# EAGLE design UHF_RFID_Nano_Shield (EAGLE 7.2.0)
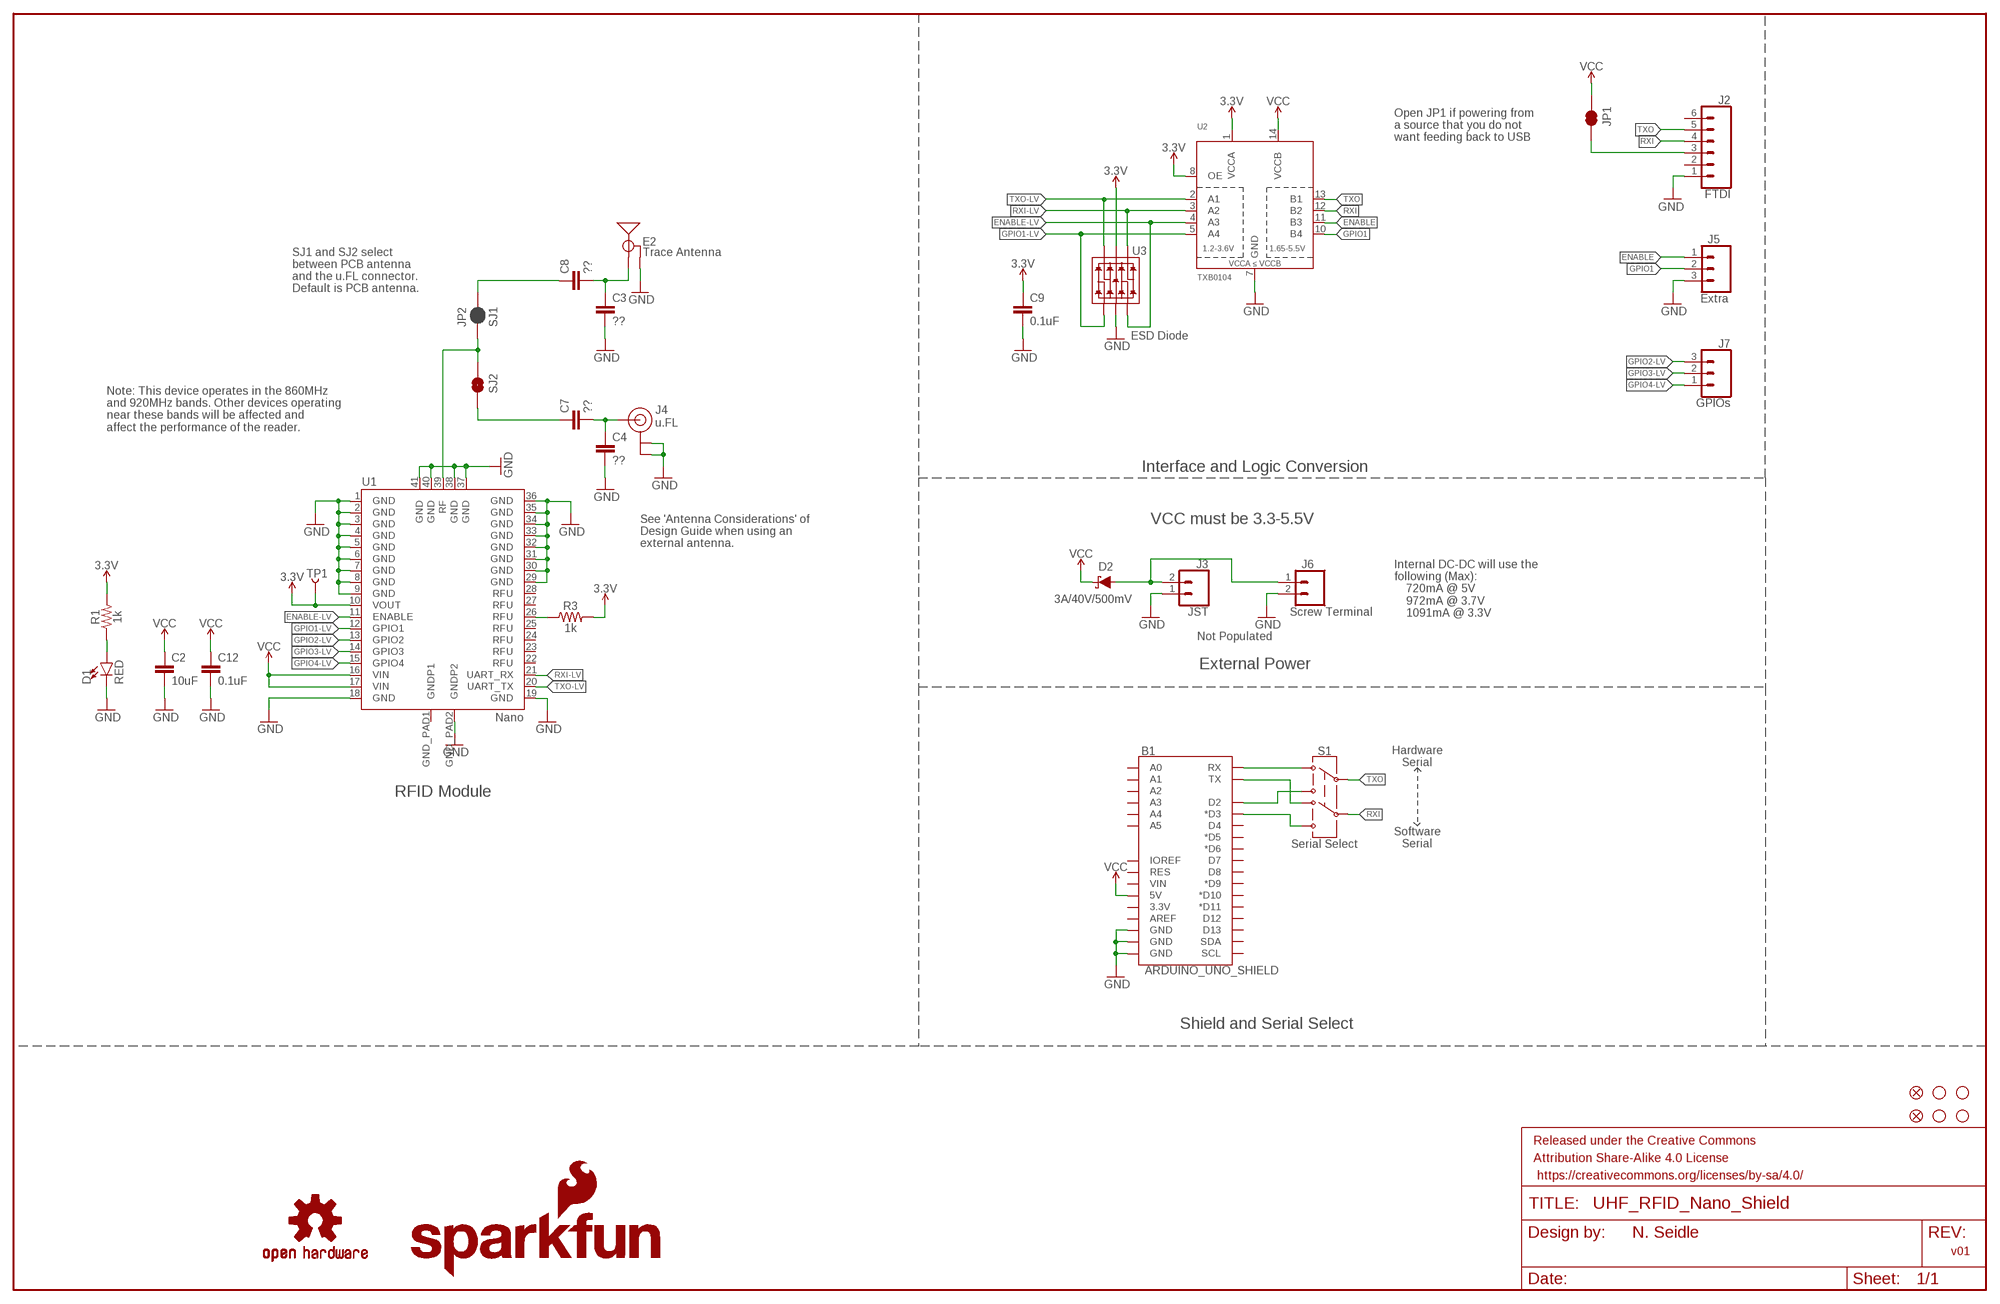
[diagram p0: schematic, sheet 1]

## Parts
B1  ARDUINO_UNO_SHIELD  ARDUINO_UNO_R3_SHIELDBASIC  [UNO_R3_SHIELD]
C2  10uF  10UF-0805-10V-10%  [0805]
C3  ??  1.0PF-0603-50V-25%  [0603]
C4  ??  1.0PF-0603-50V-25%  [0603]
C7  ??  1.0PF-0603-50V-25%  [0603]
C8  ??  1.0PF-0603-50V-25%  [0603]
C9  0.1uF  0.1UF-0603-25V-(+80/-20%)  [0603]
C12  0.1uF  0.1UF-0603-25V-(+80/-20%)  [0603]
D1  RED  LED-RED0603  [LED-0603]
D2  3A/40V/500mV  DIODE-SCHOTTKY-B340A  [SMA-DIODE]
E2  Trace Antenna  ANTENNA_GROUNDED1  [915MHZ_ANTENNA_TRIMBLE]
FID1  FIDUCIAL1X2  [FIDUCIAL-1X2]
FID2  FIDUCIAL1X2  [FIDUCIAL-1X2]
FRAME1  FRAME-LEDGER  [CREATIVE_COMMONS]
J2  FTDI  CONN_06SILK_FEMALE_PTH  [1X06]
J3  JST  CONN_02JST-PTH-2  [JST-2-PTH]
J4  U.FL  [U.FL]
J5  Extra  CONN_03  [1X03]
J6  Screw Terminal  CONN_023.5MM  [SCREWTERMINAL-3.5MM-2]
J7  GPIOs  CONN_03  [1X03]
JP1  JUMPER-SMT_2_NC_TRACE_SILK  [SMT-JUMPER_2_NC_TRACE_SILK]
JP2  SJ1  JUMPER-SMT_2_NO_NO-SILK  [SMT-JUMPER_2_NO_NO-SILK]
LOGO1  SFE_LOGO_NAME_FLAME.1_INCH  [SFE_LOGO_NAME_FLAME_.1]
LOGO2  OSHW-LOGOS  [OSHW-LOGO-S]
LOGO3  SFE_LOGO_NAME_FLAME.1_INCH  [SFE_LOGO_NAME_FLAME_.1]
R1  1k  1KOHM-0603-1/10W-1%  [0603]
R3  1k  1KOHM-0603-1/10W-1%  [0603]
S1  Serial Select  SWITCH-DPDT-SMD-AYZ0202  [SWITCH_DPDT_SMD_AYZ0202]
SJ2  JUMPER-SMT_2_NO_NO-SILK  [SMT-JUMPER_2_NO_NO-SILK]
STANDOFF1  STAND-OFF  [STAND-OFF]
STANDOFF2  STAND-OFF  [STAND-OFF]
STANDOFF3  STAND-OFF  [STAND-OFF]
STANDOFF4  STAND-OFF  [STAND-OFF]
TP1  TEST-POINT3  [PAD.03X.03]
U1  Nano  UHF_RFID_NANO_MODULE  [NANO_MODULE]
U2  TXB0104  TXB0104PWRSOIC14  [SO14]
U3  ESD Diode  TVS_DIODE_ARRAYSMD  [SOT-23-6]

## Nets
3.3V: C9.1 R1.2 R3.2 TP1.P$1 U1.10(VOUT) U2.1(VCCA) U2.8(OE) U3.5(VCC)
ANT3: JP2.1 SJ2.1 U1.39(RF)
ENABLE: J5.1 U2.11(B3)
ENABLE-LV: U1.11(ENABLE) U2.4(A3) U3.3(IO2)
GND [power]: B1.GND@0(GND) B1.GND@1(GND) B1.GND@2(GND) C2.2 C3.2 C4.2 C9.2 C12.2 D1.C E2.GND@1(GND) E2.GND@2(GND) E2.GND@3(GND) J2.1 J3.1 J4.P$1(GND) J4.P$2(GND) J5.3 J6.2 U1.1(GND) U1.2(GND) U1.3(GND) U1.4(GND) U1.5(GND) U1.6(GND) U1.7(GND) U1.8(GND) U1.9(GND) U1.18(GND) U1.19(GND) U1.29(GND) U1.30(GND) U1.31(GND) U1.32(GND) U1.33(GND) U1.34(GND) U1.35(GND) U1.36(GND) U1.37(GND) U1.38(GND) U1.40(GND) U1.41(GND) U1.GND_PAD2(GNDP2) U2.7(GND) U3.2(VSS)
GPIO1: J5.2 U2.10(B4)
GPIO1-LV: U1.12(GPIO1) U2.5(A4) U3.1(IO1)
GPIO2-LV: J7.3 U1.13(GPIO2)
GPIO3-LV: J7.2 U1.14(GPIO3)
GPIO4-LV: J7.1 U1.15(GPIO4)
N$1: C3.1 C8.2 E2.ANT(SIGNAL)
N$2: C8.1 JP2.2
N$3: C7.1 SJ2.2
N$4: R3.1 U1.26(RFU)
N$5: C4.1 C7.2 J4.P$3(SIGNAL)
N$6: D1.A R1.1
N$7: J2.3 JP1.2
N$8: B1.RX S1.1
N$9: B1.TX S1.4
N$12: D2.A J3.2 J6.1
RXI: J2.4 S1.5 U2.12(B2)
RXI-LV: U1.21(UART_RX) U2.3(A2) U3.4(IO3)
SOFT-RX: B1.D2 S1.3
SOFT-TX: B1.D3(*D3) S1.6
TXO: J2.5 S1.2 U2.13(B1)
TXO-LV: U1.20(UART_TX) U2.2(A1) U3.6(IO4)
VCC: B1.5V C2.1 C12.1 D2.C JP1.1 U1.16(VIN) U1.17(VIN) U2.14(VCCB)
Unconnected: B1.3.3V B1.A0 B1.A1 B1.A2 B1.A3 B1.A4 B1.A5 B1.AREF B1.D4 B1.D5(*D5) B1.D6(*D6) B1.D7 B1.D8 B1.D9(*D9) B1.D10(*D10) B1.D11(*D11) B1.D12 B1.D13 B1.IOREF B1.RES B1.SCL B1.SDA B1.VIN J2.2 J2.6 U1.22(RFU) U1.23(RFU) U1.24(RFU) U1.25(RFU) U1.27(RFU) U1.28(RFU) U1.GND_PAD1(GNDP1)

## Notes on the sheet
- Open JP1 if powering from
  a source that you do not
  want feeding back to USB
- SJ1 and SJ2 select
  between PCB antenna
  and the u.FL connector.
- Default is PCB antenna.
- u.FL
- Note: This device operates in the 860MHz
  and 920MHz bands. Other devices operating
  near these bands will be affected and 
  affect the performance of the reader.
- Interface and Logic Conversion
- VCC must be 3.3-5.5V
- See 'Antenna Considerations' of 
  Design Guide when using an 
  external antenna.
- Internal DC-DC will use the 
  following (Max): 
      720mA @ 5V
      972mA @ 3.7V
      1091mA @ 3.3V
- Not Populated
- External Power
- Hardware
  Serial
- RFID Module
- Software
  Serial
- Shield and Serial Select
- N. Seidle
- v01

## Library data of the parts
B1 = SparkFun-Boards:ARDUINO_UNO_R3_SHIELD: Arduino R3 Shield Footprint Shield form compatible with the Arduino Uno R3. SparkFun Products: MG2639 Cellular Shield <https://www.sparkfun.com/products/13120> MIDI Shield <https://www.sparkfun.com/products/12898> R3 Stackable Headers Kit <https://www.sparkfun.com/products/11417>
C2 = SparkFun-Capacitors:10UF: 10.0µF ceramic capacitors A capacitor is a passive two-terminal electrical component used to store electrical energy temporarily in an electric field.; PROD_ID: CAP-11330
C3 C4 C7 C8 = SparkFun-Capacitors:1.0PF: 1pF ceramic capacitors A capacitor is a passive two-terminal electrical component used to store electrical energy temporarily in an electric field.; PROD_ID: CAP-07879; VALUE: 1.0pF
C9 C12 = SparkFun-Capacitors:0.1UF: 0.1µF ceramic capacitors A capacitor is a passive two-terminal electrical component used to store electrical energy temporarily in an electric field.; PROD_ID: CAP-00810
D1 = SparkFun-LED:LED-RED: Red SMD LED Used in manufacturing of most products at SparkFun Packages: 0603 - SMD 0603 package [Product Link] <http://docs.avagotech.com/docs/AV02-0551EN> 0603 SMART - SMD 0603 SMART package ( more efficient and expensive)[Product Link] <http://www.osram-os.com/Graphics/XPic2/00077099_0.pdf> 1206 - SMD1206 package [Product Link] <https://www.sparkfun.com/datasheets/DevTools/LilyPad/Q150OVS4.pdff> SparkFun Products: Pro Mini 328 -5V <https://www.sparkfun.com/products/821> RedBoard <https://www.sparkfun.com/products/12757> IOIO-OTG <https://www.sparkfun.com/products/13613>; PROD_ID: DIO-00819
D2 = SparkFun-DiscreteSemi:DIODE-SCHOTTKY: Schottky diode A Schottky diode is a semiconductor diode which has a low forward voltage drop and a very fast switching action.; PROD_ID: DIO-09886
E2 = UHF_RFID_Nano_Module:ANTENNA_GROUNDED
FID1 FID2 = SparkFun-Aesthetics:FIDUCIAL: Fiducial Alignment Points Point-of-reference for pick-and-place machines and other optical instruments.
FRAME1 = SparkFun-Aesthetics:FRAME-LEDGER: Schematic Frame - Ledger Standard 11x14 US Ledger frame
J2 = SparkFun-Connectors:CONN_06: Multi connection point. Often used as Generic Header-pin footprint for 0.1 inch spaced/style header connections On any of the 0.1 inch spaced packages, you can populate with these: Break Away Headers - Straight <https://www.sparkfun.com/products/116> (PRT-00116) Break Away Male Headers - Right Angle <https://www.sparkfun.com/products/553> (PRT-00553) Female Headers <https://www.sparkfun.com/products/115> (PRT-00115) Break Away Headers - Machine Pin <https://www.sparkfun.com/products/117> (PRT-00117) Break Away Female Headers - Swiss Machine Pin <https://www.sparkfun.com/products/743> (PRT-00743) Arduino Stackable Header - 6 Pin <https://www.sparkfun.com/products/9280> (PRT-09280) For SCREWTERMINALS and SPRING TERMINALS visit here: Screw Terimnals on SparkFun.com <https://www.sparkfun.com/search/results?term=Screw+Terminals> (5mm/3.5mm/2.54mm spacing) This device is also useful as a general connection point to wire up your design to another part of your project. Our various solder wires solder well into these plated through hole pads. Hook-Up Wire - Assortment (Stranded, 22 AWG) <https://www.sparkfun.com/products/11375> (PRT-11375) Hook-Up Wire - Assortment (Solid Core, 22 AWG) <https://www.sparkfun.com/products/11367> (PRT-11367) View the entire wire category on our website here <https://www.sparkfun.com/categories/141> Special notes: Molex polarized connector foot print use with SKU : PRT-08231 with associated crimp pins and housings. 1MM SMD Version SKU: PRT-10208 NOTES ON THE VARIANTS LOCK and LOCK_LONGPADS... This footprint was designed to help hold the alignment of a through-hole component (i.e. 6-pin header) while soldering it into place. You may notice that each hole has been shifted either up or down by 0.005 of an inch from it's more standard position (which is a perfectly straight line). This slight alteration caused the pins (the squares in the middle) to touch the edges of the holes. Because they are alternating, it causes a "brace" to hold the component in place. 0.005 has proven to be the perfect amount of "off-center" position when using our standard breakaway headers. Although looks a little odd when you look at the bare footprint, once you have a header in there, the alteration is very hard to notice. Also,if you push a header all the way into place, it is covered up entirely on the bottom side.; PROD_ID: CONN-08437
J3 = SparkFun-Connectors:CONN_02: Multi connection point. Often used as Generic Header-pin footprint for 0.1 inch spaced/style header connections On any of the 0.1 inch spaced packages, you can populate with these: Break Away Headers - Straight <https://www.sparkfun.com/products/116> (PRT-00116) Break Away Male Headers - Right Angle <https://www.sparkfun.com/products/553> (PRT-00553) Female Headers <https://www.sparkfun.com/products/115> (PRT-00115) Break Away Headers - Machine Pin <https://www.sparkfun.com/products/117> (PRT-00117) Break Away Female Headers - Swiss Machine Pin <https://www.sparkfun.com/products/743> (PRT-00743) For SCREWTERMINALS and SPRING TERMINALS visit here: Screw Terimnals on SparkFun.com <https://www.sparkfun.com/search/results?term=Screw+Terminals> (5mm/3.5mm/2.54mm spacing) This device is also useful as a general connection point to wire up your design to another part of your project. Our various solder wires solder well into these plated through hole pads. Hook-Up Wire - Assortment (Stranded, 22 AWG) <https://www.sparkfun.com/products/11375> (PRT-11375) Hook-Up Wire - Assortment (Solid Core, 22 AWG) <https://www.sparkfun.com/products/11367> (PRT-11367) View the entire wire category on our website here <https://www.sparkfun.com/categories/141> Special notes: Molex polarized connector foot print use with: PRT-08233 with associated crimp pins and housings. 2.54_SCREWTERM for use with PRT-10571. 3.5mm Screw Terminal footprints for PRT-08084 5mm Screw Terminal footprints for use with PRT-08432; PROD_ID: CONN-09863; SKU: PRT-09914
J4 = SparkFun-Connectors:U.FL: SMD antenna connector- WRL-09144; PROD_ID: CONN-09193
J5 J7 = SparkFun-Connectors:CONN_03: Multi connection point. Often used as Generic Header-pin footprint for 0.1 inch spaced/style header connections On any of the 0.1 inch spaced packages, you can populate with these: Break Away Headers - Straight <https://www.sparkfun.com/products/116> (PRT-00116) Break Away Male Headers - Right Angle <https://www.sparkfun.com/products/553> (PRT-00553) Female Headers <https://www.sparkfun.com/products/115> (PRT-00115) Break Away Headers - Machine Pin <https://www.sparkfun.com/products/117> (PRT-00117) Break Away Female Headers - Swiss Machine Pin <https://www.sparkfun.com/products/743> (PRT-00743) Stackable Header - 3 Pin (Female, 0.1") <https://www.sparkfun.com/products/13875> (PRT-13875) For SCREWTERMINALS and SPRING TERMINALS visit here: Screw Terimnals on SparkFun.com <https://www.sparkfun.com/search/results?term=Screw+Terminals> (5mm/3.5mm/2.54mm spacing) This device is also useful as a general connection point to wire up your design to another part of your project. Our various solder wires solder well into these plated through hole pads. Hook-Up Wire - Assortment (Stranded, 22 AWG) <https://www.sparkfun.com/products/11375> (PRT-11375) Hook-Up Wire - Assortment (Solid Core, 22 AWG) <https://www.sparkfun.com/products/11367> (PRT-11367) View the entire wire category on our website here <https://www.sparkfun.com/categories/141> Special notes: Molex polarized connector foot print use with SKU : PRT-08232 with associated crimp pins and housings.
J6 = SparkFun-Connectors:CONN_02: Multi connection point. Often used as Generic Header-pin footprint for 0.1 inch spaced/style header connections On any of the 0.1 inch spaced packages, you can populate with these: Break Away Headers - Straight <https://www.sparkfun.com/products/116> (PRT-00116) Break Away Male Headers - Right Angle <https://www.sparkfun.com/products/553> (PRT-00553) Female Headers <https://www.sparkfun.com/products/115> (PRT-00115) Break Away Headers - Machine Pin <https://www.sparkfun.com/products/117> (PRT-00117) Break Away Female Headers - Swiss Machine Pin <https://www.sparkfun.com/products/743> (PRT-00743) For SCREWTERMINALS and SPRING TERMINALS visit here: Screw Terimnals on SparkFun.com <https://www.sparkfun.com/search/results?term=Screw+Terminals> (5mm/3.5mm/2.54mm spacing) This device is also useful as a general connection point to wire up your design to another part of your project. Our various solder wires solder well into these plated through hole pads. Hook-Up Wire - Assortment (Stranded, 22 AWG) <https://www.sparkfun.com/products/11375> (PRT-11375) Hook-Up Wire - Assortment (Solid Core, 22 AWG) <https://www.sparkfun.com/products/11367> (PRT-11367) View the entire wire category on our website here <https://www.sparkfun.com/categories/141> Special notes: Molex polarized connector foot print use with: PRT-08233 with associated crimp pins and housings. 2.54_SCREWTERM for use with PRT-10571. 3.5mm Screw Terminal footprints for PRT-08084 5mm Screw Terminal footprints for use with PRT-08432; PROD_ID: CONN-08399
JP1 = SparkFun-Jumpers:JUMPER-SMT_2_NC_TRACE: Normally closed trace jumper This jumper has a trace between two pads so it's normally closed (NC). Use a razor knife to open the connection. For best results follow the IPC guidelines for cutting traces: Cutout at least 0.063 mm (0.005 in). Remove all loose material to clean up the cut area. Seal the cut with an approved epoxy. Reapply solder to reclose the connection.
JP2 SJ2 = SparkFun-Jumpers:JUMPER-SMT_2_NO: Normally open jumper This jumper has two pads in close proximity to each other. Apply solder to close the connection. Round pads are easier to solder for beginners, but are a lot larger. SparkFun Product that uses the round pads: SparkFun EL Sequencer <https://www.sparkfun.com/products/12781>
LOGO1 LOGO3 = SparkFun-Aesthetics:SFE_LOGO_NAME_FLAME: SparkFun Font Logo w/ Flame This is the SparkFun full logo. The logo on the schematic will always be the same size; the package variant is the height of the flame part of the logo. Default layer for the logo on the board is tSilk.
LOGO2 = SparkFun-Aesthetics:OSHW-LOGO: Open-Source Hardware (OSHW) Logo This logo indicates the piece of hardware it is found on incorporates a OSHW license and/or adheres to the definition of open source hardware found here: http://freedomdefined.org/OSHW
R1 R3 = SparkFun-Resistors:1KOHM: 1kΩ resistor A resistor is a passive two-terminal electrical component that implements electrical resistance as a circuit element. Resistors act to reduce current flow, and, at the same time, act to lower voltage levels within circuits. - Wikipedia; PROD_ID: RES-07856
S1 = SparkFun-Switches:SWITCH-DPDT: Double-Pole, Double-Throw (DPDT) Switch Double-pole, double-throw switches. Variant Overview PTH-GPI-152-3013 Used on SparkFun Geiger Counter <https://www.sparkfun.com/products/11345> SMD-AY0202 Surface Mount DPDT Switch <https://www.sparkfun.com/products/597> (COM-00597) Used on e.g. LilyPad Arduino USB - ATmega32U4 Board <https://www.sparkfun.com/products/12049>; PROD_ID: SWCH-08179; SF_SKU: COM-00597
STANDOFF1-STANDOFF4 = SparkFun-Electromechanical:STAND-OFF: #4 Stand Off This is the mechanical footprint for a #4 phillips button head screw. Use the keepout ring to avoid running the screw head into surrounding components. SKU : PRT-00447
TP1 = SparkFun-Connectors:TEST-POINT: Bare copper test points for troubleshooting or ICT
U1 = UHF_RFID_Nano_Module:UHF_RFID_NANO_MODULE: UHF 860 and 920MHz RFID Module from ThingMagic; PROD_ID: IC-13540
U2 = SparkFun-IC-Comms:TXB0104PWR: 4-Bit Bi-Directional Level Shifter 1.2V-3.6V (VCCA) to 1.65V-5.5V (VCCB) bi-directional level shifter with auto direction sensing. Max data rate - VCCA 1.8V: 20Mbps (50ns), VCCA 3.3V: 100Mbps (10ns) Digikey: 296-21929-1-ND (TSSOP) Datasheet <http://cdn.sparkfun.com/datasheets/BreakoutBoards/txb0104.pdf> SparkFun Products SparkFun Cellular Shield - MG2639 <https://www.sparkfun.com/products/13120> (CEL-13120) SparkFun Level Shifting microSD Breakout <https://www.sparkfun.com/products/13743> (DEV-13743) SparkFun Voltage-Level Translator Breakout - TXB0104 <https://www.sparkfun.com/products/11771> (BOB-11771) SparkFun Block for Intel® Edison - UART <https://www.sparkfun.com/products/13040> (DEV-13040) SparkFun Block for Intel® Edison - Arduino <https://www.sparkfun.com/products/13036> (DEV-13036); PROD_ID: IC-11329
U3 = UHF_RFID_Nano_Module:TVS_DIODE_ARRAY; PROD_ID: IC-13538

## Net classes
1 power: width 0.203 mm

## Board
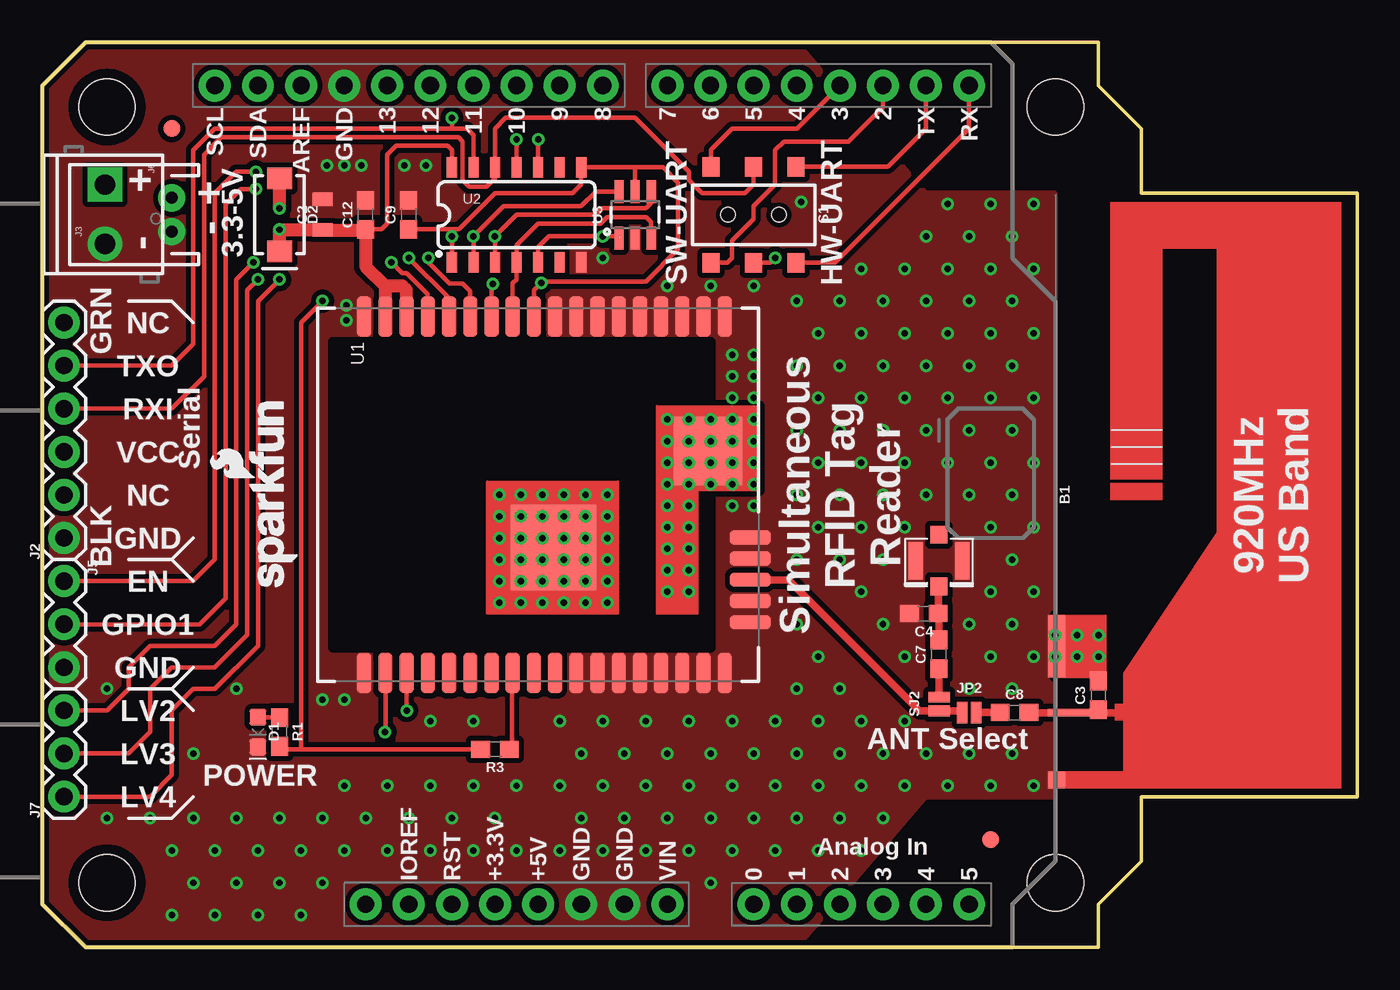
[diagram p1: board, top side]
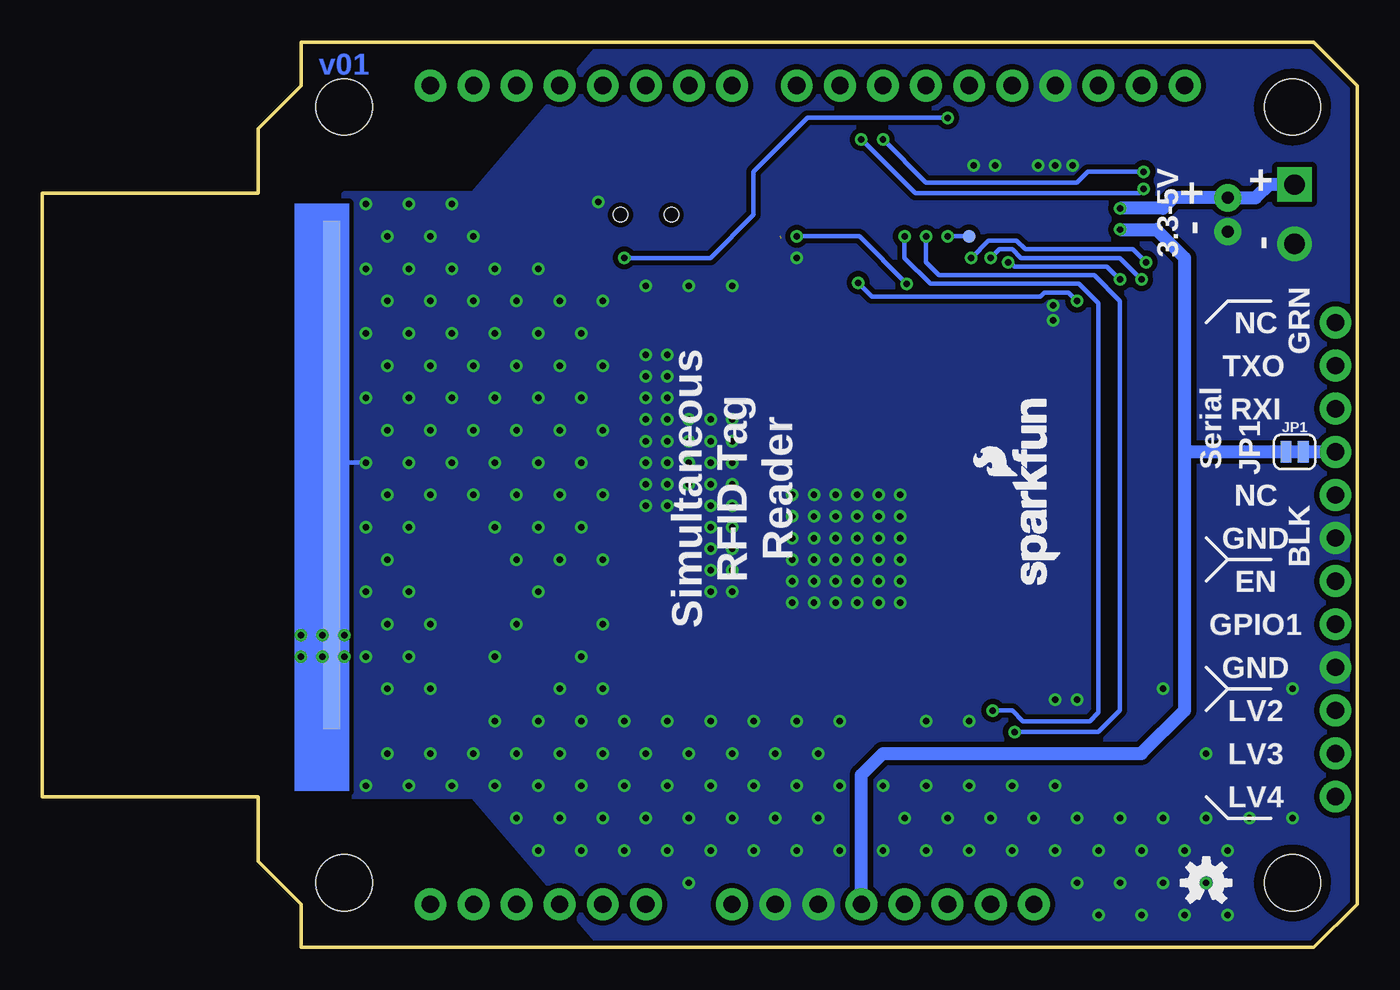
[diagram p2: board, bottom side, seen from below]

Size 77.47 x 53.34 mm. Coordinates in mm from the lower left corner, seen from the top.
Outline: 62.23,53.34 62.23,50.8 64.77,48.26 64.77,44.45 77.47,44.45 77.47,8.89 64.77,8.89 64.77,5.08 62.23,2.54 62.23,0 2.54,0 0,2.54 0,50.8 2.54,53.34 62.23,53.34
Copper layers (1*16): Top 0.035mm / dielectric 1.5mm / Bottom 0.035mm
Design rules "SparkFun-2-layer-TIGHT": minimum track width 7mil, minimum drill 15mil, track to track 7mil, track to pad 7mil, pad to pad 7mil, via to via 7mil, smd to smd 7mil, copper to edge 7mil, drill to drill 7mil, minimum pad ring 7mil, minimum via ring 7mil, stop-mask expansion 4mil, vias tented up to drill 20mil, thermal gap 10mil

### Footprints (pad centres in the part's own frame; a part is rotated, then mirrored left to right if it is on the bottom)
UNO_R3_SHIELD = drill 1.016 pad 1.88: 3.3V 24.13,-2.54; 5V 24.13,0; A0 24.13,12.7; A1 24.13,15.24; A2 24.13,17.78; A3 24.13,20.32; A4 24.13,22.86; A5 24.13,25.4; AREF -24.13,-13.97; D2 -24.13,20.32; D3 -24.13,17.78; D4 -24.13,15.24; D5 -24.13,12.7; D6 -24.13,10.16; D7 -24.13,7.62; D8 -24.13,3.81; D9 -24.13,1.27; D10 -24.13,-1.27; D11 -24.13,-3.81; D12 -24.13,-6.35; D13 -24.13,-8.89; GND@0 24.13,2.54; GND@1 24.13,5.08; GND@2 -24.13,-11.43; IOREF 24.13,-7.62; NC 24.13,-10.16; RES 24.13,-5.08; RX -24.13,25.4; SCL -24.13,-19.05; SDA -24.13,-16.51; TX -24.13,22.86; VIN 24.13,7.62
0805 = smd 0.8 x 1.2: 1 -0.9,0; 2 0.9,0
0603 = smd 1.1 x 1: 1 -0.85,0; 2 0.85,0
LED-0603 = smd 1 x 1: A -0.877,0; C 0.877,0
SMA-DIODE = smd 1.27 x 1.47: A -2.15,0; C 2.15,0
915MHZ_ANTENNA_TRIMBLE = smd 0.44 x 3: ANT -0.006,-1.315 | smd 1.02 x 1: GND@1 -3.966,-0.315 | smd 3.677 x 1: GND@2 3.909,-0.315 | smd 30 x 1 bottom: GND@3 14,-1
FIDUCIAL-1X2 = smd 1 x 1: 1 0,0
1X06 = drill 1.016 pad 1.88: 1 0,0; 2 2.54,0; 3 5.08,0; 4 7.62,0; 5 10.16,0; 6 12.7,0
JST-2-PTH = drill 0.7 pad 1.6: 1 -1,0; 2 1,0
U.FL = smd 2.2 x 0.85: P$1 0,1.375; P$2 0,-1.375 | smd 1.05 x 1: P$3 1.525,0; P$4 -1.525,0
1X03 = drill 1.016 pad 1.88: 1 0,0; 2 2.54,0; 3 5.08,0
SCREWTERMINAL-3.5MM-2 = drill 1.2 pad 2.032 square: 1 0,0 | drill 1.2 pad 2.032: 2 3.5,0
SMT-JUMPER_2_NC_TRACE_SILK = smd 0.635 x 1.27: 1 -0.508,0; 2 0.508,0
SMT-JUMPER_2_NO_NO-SILK = smd 0.635 x 1.27: 1 -0.406,0; 2 0.406,0
SWITCH_DPDT_SMD_AYZ0202 = smd 1 x 1.15: 1 -2.5,2.825; 2 0,2.825; 3 2.5,2.825; 4 -2.5,-2.825; 5 0,-2.825; 6 2.5,-2.825 | hole 0.85: 1.5,0; -1.5,0
STAND-OFF = hole 3.302: 0,0
PAD.03X.03 = smd 0.762 x 0.762: P$1 0,0
NANO_MODULE = smd 2.4 x 0.85: 1 -10.5,11; 2 -10.5,9.75; 3 -10.5,8.5; 4 -10.5,7.25; 5 -10.5,6; 6 -10.5,4.75; 7 -10.5,3.5; 8 -10.5,2.25; 9 -10.5,1; 10 -10.5,-0.25; 11 -10.5,-1.5; 12 -10.5,-2.75; 13 -10.5,-4; 14 -10.5,-5.25; 15 -10.5,-6.5; 16 -10.5,-7.75; 17 -10.5,-9; 18 -10.5,-10.25; 19 10.5,-10.25; 20 10.5,-9; 21 10.5,-7.75; 22 10.5,-6.5; 23 10.5,-5.25; 24 10.5,-4; 25 10.5,-2.75; 26 10.5,-1.5; 27 10.5,-0.25; 28 10.5,1; 29 10.5,2.25; 30 10.5,3.5; 31 10.5,4.75; 32 10.5,6; 33 10.5,7.25; 34 10.5,8.5; 35 10.5,9.75; 36 10.5,11 | smd 0.85 x 2.4: 37 7.5,12.5; 38 6.25,12.5; 39 5,12.5; 40 3.75,12.5; 41 2.5,12.5 | smd 5 x 5: GND_PAD1 3.1,0.9 | smd 4 x 4: GND_PAD2 -2.6,10
SO14 = smd 0.6 x 1.2: 1 -3.81,-2.8; 2 -2.54,-2.8; 3 -1.27,-2.8; 4 0,-2.8; 5 1.27,-2.8; 6 2.54,-2.8; 7 3.81,-2.8; 8 3.81,2.8; 9 2.54,2.8; 10 1.27,2.8; 11 0,2.8; 12 -1.27,2.8; 13 -2.54,2.8; 14 -3.81,2.8
SOT-23-6 = smd 0.55 x 1.35: 1 -0.95,-1.375; 2 0,-1.375; 3 0.95,-1.375; 4 0.95,1.375; 5 0,1.375; 6 -0.95,1.375

### Placement (x,y rotation side)
B1  29.21,26.67 270 top
C2  16.51,43.18 90 top
C3  62.23,14.86 90 top
C4  51.94,19.68 180 top
C7  52.83,17.27 90 top
C8  57.28,13.84 0 top
C9  21.59,43.18 90 top
C12  19.05,43.18 90 top
D1  12.7,12.7 270 top
D2  13.97,43.18 270 top
E2  59.44,13.84 90 top
FID1  7.62,48.26 270 top
FID2  55.88,6.35 90 top
FRAME1  -1.27,-29.21 0 top  (outside the outline)
J2  1.27,24.13 90 top
J3  7.62,43.18 90 top
J4  52.83,22.8 270 top
J5  1.27,21.59 270 top
J6  3.68,44.96 270 top
J7  1.27,8.89 90 top
JP1  3.68,29.21 0 bottom
JP2  54.61,13.84 0 top
LOGO1  15.11,20.83 90 top
LOGO2  8.89,3.81 0 bottom
LOGO3  17.4,20.95 90 bottom
R1  13.97,12.7 270 top
R3  26.67,11.68 180 top
S1  41.91,43.18 180 top
SJ2  52.83,14.35 90 top
STANDOFF1  3.81,49.53 90 top
STANDOFF2  59.69,49.53 270 top
STANDOFF3  59.69,3.81 90 top
STANDOFF4  3.81,3.81 90 top
TP1  22.86,41.91 0 bottom
U1  29.21,26.67 270 top
U2  27.94,43.18 0 top
U3  34.92,43.18 0 top

### Tracks (layer width: path | path; a pad name or v marks a point on that pad's centre or on a via)
3.3V  (via drill 0.38)
  Top 0.254: 34.92,45.97 36.58,45.97 37.47,45.09 37.47,41.15 35.56,39.24 29.46,39.24 v29.4,39.18 28.96,38.74 U1.10 | 34.92,45.97 U2.8 31.75,44.96 31.24,44.45 26.67,44.45 24.55,42.33 24.13,42.33 | U2.1 v24.13,41.91 24.13,42.33 | C9.1 24.13,42.33 | R3.2 15.24,11.68 | 15.24,11.68 14.14,11.68 R1.2 | U3.5 34.92,45.97 | 15.24,11.68 15.24,36.83 v16.51,38.1
  Bottom 0.254: TP1.P$1 v24.13,41.91 | v16.51,38.1 17.02,38.61 18.41,38.61 18.67,38.35 28.57,38.35 v29.4,39.18
ANT3
  Top 0.44: U1.39 43.96,21.67 51.69,13.95 SJ2.1 54.1,13.95 JP2.1
ENABLE  (via drill 0.38)
  Top 0.254: J5.1 8.89,21.59 10.16,22.86 10.16,44.45 11.43,45.72 v12.57,45.72 | v27.94,47.62 U2.11
  Bottom 0.254: v27.94,47.62 25.4,45.09 16.51,45.09 15.88,45.72 v12.57,45.72
ENABLE-LV
  Top 0.254: U1.11 27.71,39.14 27.94,39.37 U2.4 27.94,41.4 29.21,42.67 32.89,42.67 33.27,43.05 35.56,43.05 35.88,42.74 U3.3
GND  (via drill 0.38)
  Top 0.254: C3.2 v62.23,17.14 | v62.23,17.14 62.23,17.78 | 60.96,17.78 59.97,17.78 59.95,17.75 E2.GND@2 | v62.23,17.14 v62.23,18.41 v60.96,18.41 60.96,17.78 | 60.96,17.78 v60.96,17.14
  Bottom 0.254: 59.95,28.57 59.69,28.57 | 59.69,28.57 v58.42,28.57 | E2.GND@3 60.42,27.84 59.69,28.57
  other vias: 59.69,18.41 59.69,17.14 57.15,11.43 57.15,19.05 57.15,22.86 57.15,26.67 57.15,30.48 57.15,34.29 57.15,41.91 57.15,38.1 57.15,15.24 58.42,9.53 58.42,17.14 58.42,20.95 58.42,24.77 58.42,32.38 58.42,40.01 58.42,36.2 58.42,43.81 54.61,11.43 54.61,19.05 54.61,26.67 54.61,30.48 54.61,34.29 54.61,41.91 54.61,38.1 54.61,15.24 55.88,17.14 55.88,20.95 55.88,24.77 55.88,28.57 55.88,32.38 55.88,40.01 55.88,36.2 52.07,11.43 52.07,26.67 52.07,30.48 52.07,34.29 52.07,41.91 52.07,38.1 53.34,9.53 53.34,28.57 53.34,32.38 53.34,40.01 53.34,36.2 53.34,43.81 49.53,11.43 49.53,19.05 49.53,22.86 49.53,26.67 49.53,30.48 49.53,34.29 49.53,38.1 50.8,9.53 50.8,17.14 50.8,24.77 50.8,28.57 50.8,32.38 50.8,40.01 50.8,36.2 50.8,13.34 46.99,11.43 46.99,22.86 46.99,26.67 46.99,30.48 46.99,34.29 46.99,38.1 46.99,15.24 48.26,9.53 48.26,20.95 48.26,24.77 48.26,28.57 48.26,32.38 48.26,36.2 48.26,13.34 44.45,11.43 44.45,19.05 44.45,22.86 44.45,26.67 44.45,30.48 44.45,34.29 44.45,38.1 44.45,15.24 45.72,9.53 45.72,17.14 45.72,24.77 45.72,28.57 45.72,32.38 45.72,36.2 45.72,13.34 44.7,43.94 33.02,9.53 41.91,11.43 43.18,9.53 39.37,11.43 40.64,9.53 36.83,11.43 38.1,9.53 34.29,11.43 35.56,9.53 39.37,7.62 40.64,5.71 36.83,7.62 38.1,5.71 34.29,7.62 35.56,5.71 33.02,5.71 43.18,13.34 40.64,13.34 38.1,13.34 35.56,13.34 33.02,13.34 49.53,7.62 46.99,7.62 48.26,5.71 44.45,7.62 45.72,5.71 41.91,7.62 43.18,5.71 17.78,9.53 8.89,11.43 13.97,7.62 15.24,5.71 12.7,5.71 8.89,7.62 10.16,5.71 7.62,5.71 17.78,14.61 11.43,15.24 19.05,7.62 16.51,7.62 17.78,5.71 31.75,11.43 20.32,9.53 30.48,9.53 27.94,9.53 25.4,9.53 22.86,9.53 26.67,7.62 27.94,5.71 24.13,7.62 25.4,5.71 21.59,7.62 22.86,5.71 20.32,5.71 30.48,13.34 25.4,13.34 22.86,13.34 31.75,7.62 30.48,5.71 15.24,1.91 12.7,1.91 10.16,1.91 7.62,1.91 13.97,3.81 11.43,3.81 8.89,3.81 3.81,15.24 6.35,7.62 3.81,7.62 33.02,40.64 36.83,38.99 39.37,38.99 41.91,38.99 18.8,46.1 17.78,46.1 16.76,46.1 21.34,46.1 22.61,46.1 11.43,7.62 16.51,14.61 17.91,37.85 17.91,36.96 48.26,40.01 16.51,3.81 55.88,9.53 55.88,43.81 39.37,3.81 38.1,31.11 36.83,31.11 36.83,29.84 38.1,29.84 38.1,28.57 36.83,28.57 36.83,27.3 38.1,27.3 38.1,26.04 36.83,26.04 36.83,24.77 38.1,24.77 38.1,23.5 36.83,23.5 36.83,22.23 38.1,22.23 38.1,20.95 36.83,20.95 29.46,26.67 30.73,26.67 30.73,25.4 29.46,25.4 29.46,24.13 30.73,24.13 30.73,22.86 29.46,22.86 29.46,21.59 30.73,21.59 30.73,20.32 29.46,20.32 32,26.67 33.27,26.67 33.27,25.4 32,25.4 32,24.13 33.27,24.13 33.27,22.86 32,22.86 32,21.59 33.27,21.59 33.27,20.32 32,20.32 26.92,26.67 28.19,26.67 28.19,25.4 26.92,25.4 26.92,24.13 28.19,24.13 28.19,22.86 26.92,22.86 26.92,21.59 28.19,21.59 28.19,20.32 26.92,20.32 40.64,26.04 41.91,26.04 40.64,31.11 40.64,29.84 40.64,28.57 40.64,27.3 41.91,31.11 41.91,29.84 41.91,28.57 41.91,27.3 39.37,31.11 39.37,29.84 39.37,28.57 39.37,27.3 40.64,34.92 40.64,33.66 40.64,32.38 41.91,32.38 41.91,33.66 41.91,34.92
  pour Top (isolate 0.305, rank 6, no thermals): 0,53.34 0,0 44.45,0 52.07,8.89 59.69,8.89 59.69,44.45 52.07,44.45 44.45,53.34
  pour Bottom (isolate 0.305, rank 6, no thermals): 0,53.34 0,0 44.45,0 52.07,8.89 59.69,8.89 59.69,44.45 52.07,44.45 44.45,53.34
GPIO1  (via drill 0.38)
  Top 0.254: J5.2 9.27,19.05 10.79,20.57 10.79,43.81 11.68,44.7 v12.57,44.7 | U2.10 v29.21,47.62
  Bottom 0.254: v29.21,47.62 26.04,44.45 12.83,44.45 v12.57,44.7
GPIO1-LV  (via drill 0.38)  (1 unrouted)
  Top 0.254: U2.5 29.21,41.27 29.84,41.91 v33.02,41.91 34,41.91 | U1.12 26.46,39.03 v26.54,39.12
  Bottom 0.254: v33.02,41.91 29.34,41.91 v26.54,39.12
GPIO2-LV  (via drill 0.38)
  Top 0.254: U1.13 25.21,38.67 24.77,39.12 24,39.12 22.73,40.39 v22.73,40.64 | v12.45,40.39 11.43,39.37 11.43,19.05 10.16,17.78 6.35,17.78 5.08,16.51 5.08,15.24 3.81,13.97 J7.3
  Bottom 0.254: v22.73,40.64 21.72,41.66 20.07,41.66 19.56,41.15 13.21,41.15 v12.45,40.39
GPIO3-LV  (via drill 0.38)
  Top 0.254: U1.14 23.96,38.27 v21.59,40.64 | J7.2 5.08,11.43 6.35,12.7 6.35,15.24 7.62,16.51 10.16,16.51 12.06,18.41 12.06,38.73 v12.7,39.37
  Bottom 0.254: v21.59,40.64 21.08,41.15 20.32,41.15 19.81,40.64 13.97,40.64 v12.7,39.37
GPIO4-LV  (via drill 0.38)
  Top 0.254: U1.15 22.71,38.5 21.46,39.75 21.21,39.75 v20.57,40.39 | J7.1 6.35,8.89 7.62,10.16 7.62,13.97 8.89,15.24 10.16,15.24 12.7,17.78 12.7,38.1 v13.97,39.37
  Bottom 0.254: v20.57,40.39 20.57,40.51 20.19,40.13 14.73,40.13 v13.97,39.37
N$1
  Top 0.254: E2.ANT 62.06,13.84 C3.1
  Top 0.44: E2.ANT C8.2
N$2
  Top 0.44: JP2.2 C8.1
N$3
  Top 0.44: C7.1 SJ2.2
N$4
  Top 0.254: U1.26 27.69,16.15 27.69,11.85 R3.1
N$5
  Top 0.44: C7.2 52.83,19.65 C4.1 52.79,21.23 J4.P$3
N$6
  Top 0.254: R1.1 12.73,13.55 D1.A
N$7
  Bottom 0.762: J2.3 JP1.2
N$8
  Top 0.254: S1.1 46.7,40.35 54.61,48.26 B1.RX
N$9
  Top 0.254: S1.4 49.81,46.01 52.07,48.26 B1.TX
N$10
  Bottom 0.762: 3.3,29.21 4.06,29.21
N$12  (via drill 0.38)
  Top 0.762: v13.97,43.56 D2.A
  Bottom 0.762: J6.1 5.21,44.96 5.99,44.18 J3.2 10.81,44.18 11.43,43.56 v13.97,43.56
RXI
  Top 0.254: S1.5 41.91,44.96 41.4,44.45 38.86,44.45 38.1,45.21 38.1,45.72 34.92,48.9 27.3,48.9 26.67,48.26 U2.12 26.67,45.34 26.16,44.83 25.15,44.83 24.77,45.21 24.77,47.5 24.51,47.75 10.54,47.75 9.53,46.74 9.53,33.66 7.62,31.75 J2.4
RXI-LV  (via drill 0.38)
  Top 0.254: U2.3 v26.67,41.91 27.94,43.18 32.64,43.18 33.02,43.56 35.56,43.56 35.88,43.88 U3.4 | U1.21 v21.46,13.97
  Bottom 0.254: v26.67,41.91 26.67,40.64 25.15,39.12 16.38,39.12 15.24,37.97 15.24,13.84 15.75,13.34 19.68,13.34 20.32,13.97 v21.46,13.97
SOFT-RX
  Top 0.254: S1.3 40.35,40.35 40.64,40.64 40.64,41.66 41.91,42.93 41.91,43.69 43.18,44.96 43.18,46.99 43.69,47.5 47.5,47.5 49.53,49.53 B1.D2
SOFT-TX
  Top 0.254: S1.6 39.41,47.03 40.64,48.26 44.45,48.26 B1.D3
TXO  (via drill 0.38)
  Top 0.254: 24.13,48.26 10.16,48.26 8.89,46.99 8.89,35.56 7.62,34.29 J2.5 | 24.13,48.26 25.02,48.26 25.4,47.88 U2.13 | v24.13,48.9 24.13,48.26 | S1.2 42.9,40.35 v43.18,40.64
  Bottom 0.254: v24.13,48.9 32.38,48.9 35.56,45.72 35.56,43.18 38.1,40.64 v43.18,40.64
TXO-LV  (via drill 0.38)
  Top 0.254: U2.2 v25.4,41.91 27.18,43.69 31.75,43.69 32.62,44.55 U3.6 | U1.20 20.21,12.72 v20.19,12.7
  Bottom 0.254: v20.19,12.7 15.24,12.7 13.97,13.97 13.97,38.1 15.49,39.62 24.64,39.62 U2.2 v25.4,41.91
VCC  (via drill 0.38)
  Top 0.254: C12.1 19.98,42.33 20.32,42.67 20.32,46.74 20.83,47.24 23.88,47.24 24.13,46.99 U2.14 | C2.1
  Top 0.762: U1.17 20.21,38.97 | 20.21,38.97 20.21,38.99 21.21,38.99 21.46,38.74 U1.16 | 20.21,38.97 19.05,40.13 C12.1 | C12.1 | C2.1 19,42.28 C12.1 | D2.C v13.97,42.31 16.48,42.31 C2.1
  Bottom 0.762: B1.5V 29.21,10.16 27.94,11.43 12.7,11.43 10.16,13.97 10.16,29.21 | 10.16,29.21 10.16,40.64 11.83,42.31 v13.97,42.31 | JP1.1 10.16,29.21

### Text on the board
Bottom: v01
tPlace: + | + | 3.3-5V | SW-UART | HW-UART | - | - | GRN | NC | TXO | RXI | Serial | VCC | NC | Simultaneous / RFID Tag / Reader | 920MHz / US Band | BLK | GND | EN | GPIO1 | GND | LV2 | ANT Select | LV3 | POWER | LV4
bPlace: + | + | 3.3-5V | - | - | GRN | NC | TXO | RXI | Serial | JP1 | NC | Simultaneous / RFID Tag / Reader | BLK | GND | EN | GPIO1 | GND | LV2 | LV3 | LV4
Measures: Clears 4-40 Screw | All Dimensions in Inches
tDocu: N. Seidle